# Altium schematic sheet Sheet1.SchDoc
size A4
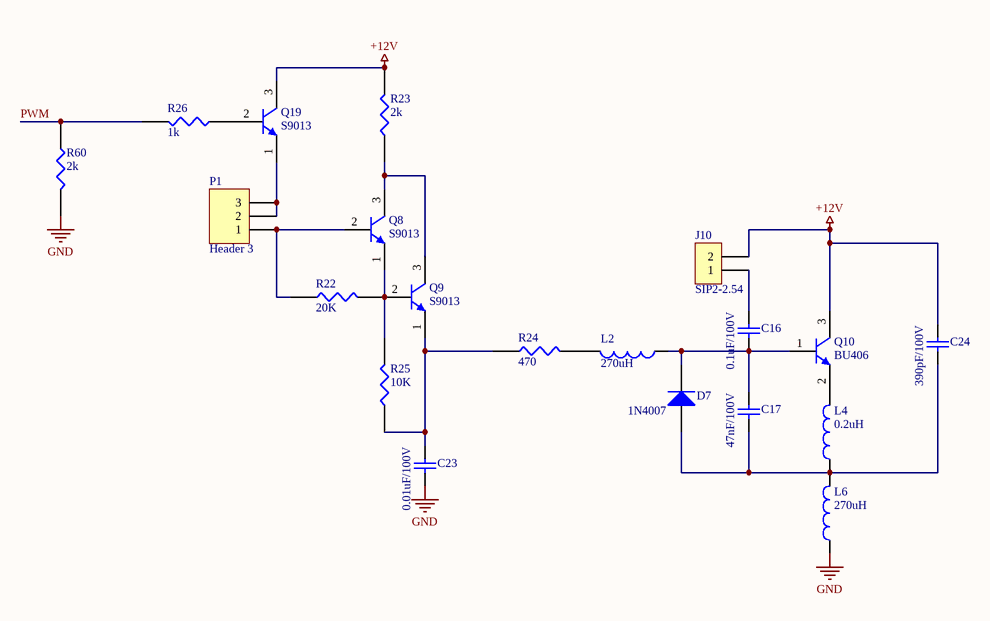
[diagram p0: Sheet1.SchDoc]

## Parts
C16  0.1uF/100V  [CAP_5MM]
C17  47nF/100V  [CAP_5MM]
C23  0.01uF/100V  [0603c]
C24  390pF/100V  [CAP_5MM]
D7  1N4007  [DIO10.46-5.3x2.8]
J10  SIP2-2.54  [SIP-2L]
L2  270uH  [6*8]
L4  0.2uH  [6*8]
L6  270uH  [6*8]
P1  Header 3  [HDR1X3]
Q8  S9013  [to-92]
Q9  S9013  [to-92]
Q10  BU406  [to220]
Q19  S9013  [to-92]
R22  20K  [0603r]
R23  2k  [0603R]
R24  470  [0805R]
R25  10K  [0603R]
R26  1k  [0603R]
R60  2k  [0603R]

## Nets
+12V: C24.2 J10.2 Q10.3(C) Q19.3(C) R23.2
GND: C23.1 L6.1 R60.2
PWM: R26.2 R60.1
NetC16_1: C16.1 C17.2 D7.2(K) L2.1 Q10.1(B)
NetC16_2: C16.2 J10.1
NetC17_1: C17.1 C24.1 D7.1(A) L4.1 L6.2
NetC23_2: C23.2 Q9.1(E) R24.1 R25.1
NetL2_2: L2.2 R24.2
NetL4_2: L4.2 Q10.2(E)
NetP1_1: P1.1 Q8.2(B) R22.1
NetP1_2: P1.2 P1.3 Q19.1(E)
NetQ8_1: Q8.1(E) Q9.2(B) R22.2 R25.2
NetQ8_3: Q8.3(C) Q9.3(C) R23.1
NetQ19_2: Q19.2(B) R26.1

## Library data of the parts
C16 C17 C23 C24 = Cap: Capacitor; Value: 1nF/100V; Published: 8-Jun-2000; LatestRevisionDate: 17-Jul-2002; LatestRevisionNote: Re-released for DXP Platform.; PackageReference: RAD-0.3; Publisher: Altium Limited
D7 = Diode_2: Default Diode; Published: 8-Jun-2000; LatestRevisionDate: 17-Jul-2002; LatestRevisionNote: Re-released for DXP Platform.; PackageVersion: Sep-1996; PackageReference: SMC; Publisher: Altium Limited; PackageDescription: DO-214-AB/SMC; 2 C-Bend Leads; Body 7.9 x 5.9 mm, inc. leads (LxW); Code_JEDEC: DO-214-AB
J10 = SIP2-2.54: CN-SIP2-2.54
L2 L4 L6 = Inductor: Code_IEC: 1005; Value: 10uH; Published: 8-Jun-2000; LatestRevisionDate: 29-May-2009; LatestRevisionNote: IPC-7351 Footprint Added.; PackageReference: 0402-A; Publisher: Altium Limited; PackageDescription: Chip Inductor; Code_JEITA: 0402
P1 = Header 3: Header, 3-Pin; LatestRevisionDate: 17-Jul-2002; LatestRevisionNote: Re-released for DXP Platform.; Publisher: Altium Limited
Q8-Q10 Q19 = NPN: NPN Bipolar Transistor; Published: 8-Jun-2000; LatestRevisionDate: 17-Jul-2002; LatestRevisionNote: Re-released for DXP Platform.; PackageReference: TO-226; Publisher: Altium Limited; Code_JEDEC: TO-226-AA
R22-R26 R60 = RES1